# Altium schematic sheet SLAVE.SchDoc
size A
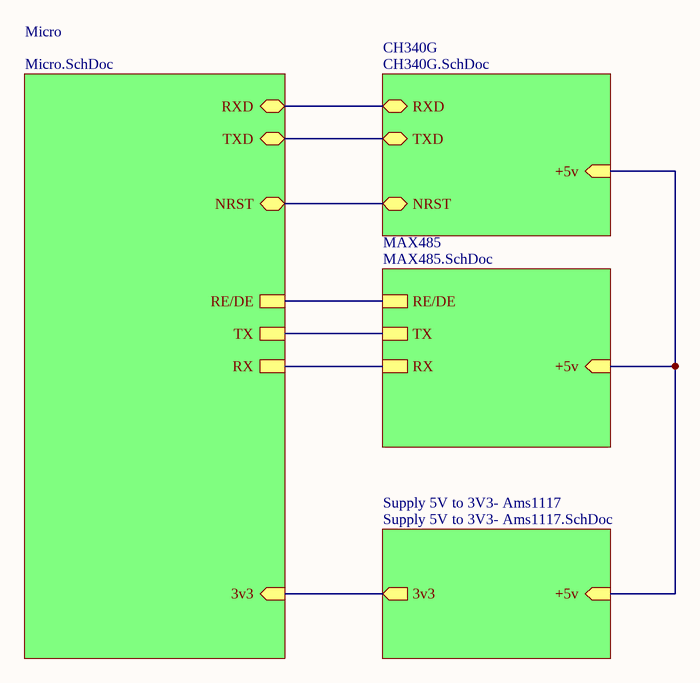
[diagram p0: SLAVE.SchDoc]

## Sub-sheets
CH340G = CH340G.SchDoc: +5v (in), RXD (bidir), TXD (bidir), NRST (bidir)
MAX485 = MAX485.SchDoc: +5v (in), RE/DE, TX, RX
Micro = Micro.SchDoc: NRST (bidir), 3v3 (in), TX, RX, RE/DE, RXD (bidir), TXD (bidir)
Supply 5V to 3V3- Ams1117 = Supply 5V to 3V3- Ams1117.SchDoc: +5v (in), 3v3 (out)

## Nets
(unnamed): sheet Micro/NRST, sheet CH340G/NRST
(unnamed): sheet Micro/3v3, sheet Supply 5V to 3V3- Ams1117/3v3
(unnamed): sheet Micro/TX, sheet MAX485/TX
(unnamed): sheet Micro/RX, sheet MAX485/RX
(unnamed): sheet Micro/RE/DE, sheet MAX485/RE/DE
(unnamed): sheet Micro/RXD, sheet CH340G/RXD
(unnamed): sheet Micro/TXD, sheet CH340G/TXD
(unnamed): sheet Supply 5V to 3V3- Ams1117/+5v, sheet CH340G/+5v, sheet MAX485/+5v